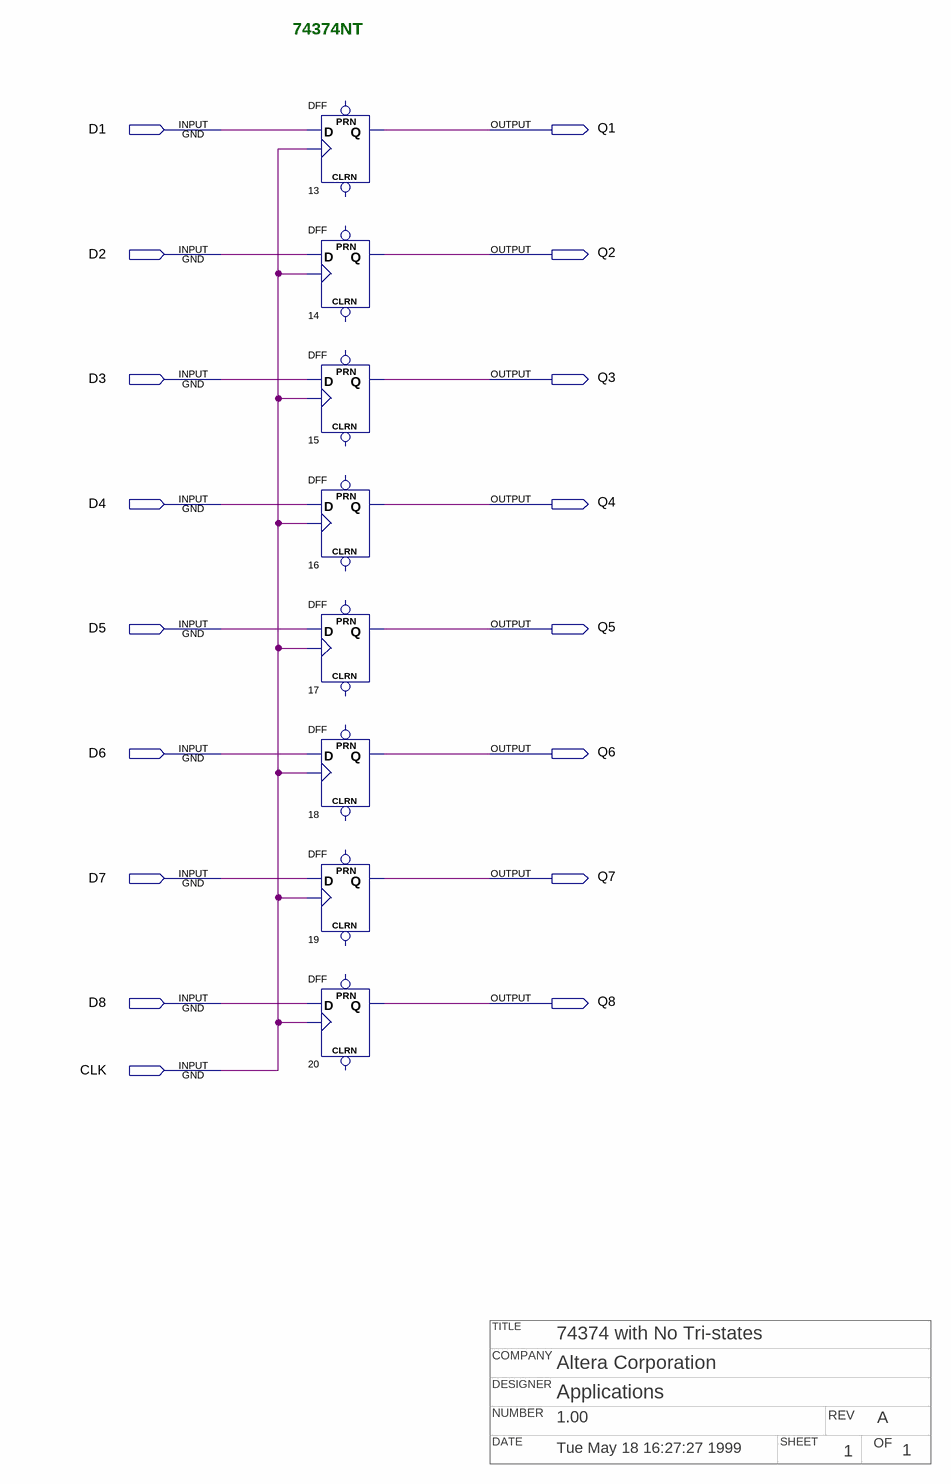
[diagram p0: schematic sheet]
// Quartus schematic 74374nt.bdf as structural Verilog: 8 symbols, 17 pins
// Title block: TITLE: 74374 with No Tri-states; COMPANY: Altera Corporation; DESIGNER: Applications; NUMBER: 1.00; REV: A; DATE: Tue May 18 16:27:27 1999; SHEET: 1; OF: 1
module \74374nt  (
  input  D1,
  input  D2,
  input  D3,
  input  D4,
  input  D5,
  input  D6,
  input  D7,
  input  D8,
  input  CLK,
  output Q1,
  output Q2,
  output Q3,
  output Q4,
  output Q5,
  output Q6,
  output Q7,
  output Q8
);

  DFF u_13 (.CLK(CLK), .D(D1), .Q(Q1));  // open: CLRN, PRN
  DFF u_14 (.CLK(CLK), .D(D2), .Q(Q2));  // open: CLRN, PRN
  DFF u_15 (.CLK(CLK), .D(D3), .Q(Q3));  // open: CLRN, PRN
  DFF u_16 (.CLK(CLK), .D(D4), .Q(Q4));  // open: CLRN, PRN
  DFF u_17 (.CLK(CLK), .D(D5), .Q(Q5));  // open: CLRN, PRN
  DFF u_18 (.CLK(CLK), .D(D6), .Q(Q6));  // open: CLRN, PRN
  DFF u_19 (.CLK(CLK), .D(D7), .Q(Q7));  // open: CLRN, PRN
  DFF u_20 (.CLK(CLK), .D(D8), .Q(Q8));  // open: CLRN, PRN

  // Notes on the sheet:
  //   74374NT
endmodule
